# Altium schematic sheet LCD PCB.SchDoc
size 406 x 304 mm; SheetNumber: 1; SheetTotal: 1
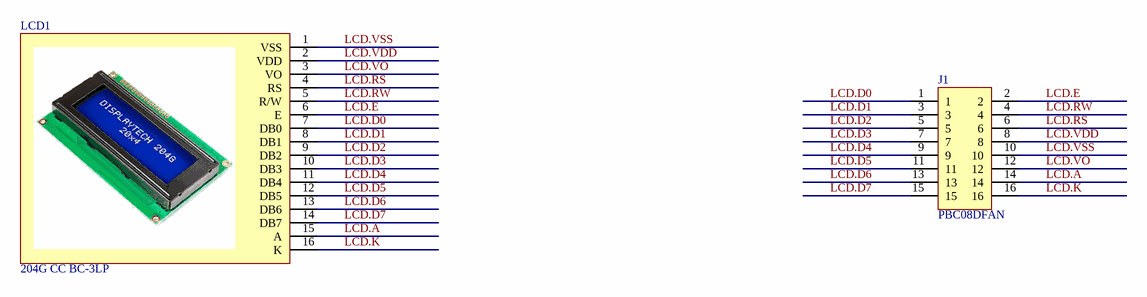
[diagram p0: LCD PCB.SchDoc]

## Parts
J1  PBC08DFAN  [SULLINS_PBC08DFAN]
LCD1  204G CC BC-3LP  [DISPLAYTECH_204G CC BC-3LP]

## Nets
LCD.A: J1.14 LCD1.15(A)
LCD.D0: J1.1 LCD1.7(DB0)
LCD.D1: J1.3 LCD1.8(DB1)
LCD.D2: J1.5 LCD1.9(DB2)
LCD.D3: J1.7 LCD1.10(DB3)
LCD.D4: J1.9 LCD1.11(DB4)
LCD.D5: J1.11 LCD1.12(DB5)
LCD.D6: J1.13 LCD1.13(DB6)
LCD.D7: J1.15 LCD1.14(DB7)
LCD.E: J1.2 LCD1.6(E)
LCD.K: J1.16 LCD1.16(K)
LCD.RS: J1.6 LCD1.4(RS)
LCD.RW: J1.4 LCD1.5(R/W)
LCD.VDD: J1.8 LCD1.2(VDD)
LCD.VO: J1.12 LCD1.3(VO)
LCD.VSS: J1.10 LCD1.1(VSS)

## Notes on the sheet
- Rev
- Sheet Name:
- Date:
- Sheet
- Designer:
- of

## Library data of the parts
J1 = Term,Header,2x8 Pin,2.54mm,Top,Thru: Connector Header Through Hole 16 position 0.100" (2.54mm); Manufacturer 1: Sullins Connector Solutions; Vendor 1 Part Number: S2211E-08-ND; Vendor 1: DigiKey; Part Name: Term,Header,2x8 Pin,2.54mm,Top,Thru; CreatedBy: Judd Foster; HelpURL: https://s3.amazonaws.com/catalogspreads-pdf/PAGE112-113%20.100%20MALE%20HDR.pdf; Manufacturer 1 Part Number: PBC08DFAN
LCD1 = Disp,Char,LCD,20x4,204G CC BC-3LP: Character Display Module Transmissive 5 x 8 Dots STN - Super-Twisted Nematic LED - White 98.00mm x 60.00mm x 13.60mm; Manufacturer 1: Displaytech; Vendor 1 Part Number: 1756-204GCCBC-3LP-ND; Vendor 1: DigiKey; Part Name: Disp,Char,LCD,20x4,204G CC BC-3LP; CreatedBy: Judd Foster; HelpURL: https://www.seacomp.com/sites/default/files/datasheets/204G-CC-BC-3LP-Displaytech-Spec.pdf; Manufacturer 1 Part Number: 204G CC BC-3LP